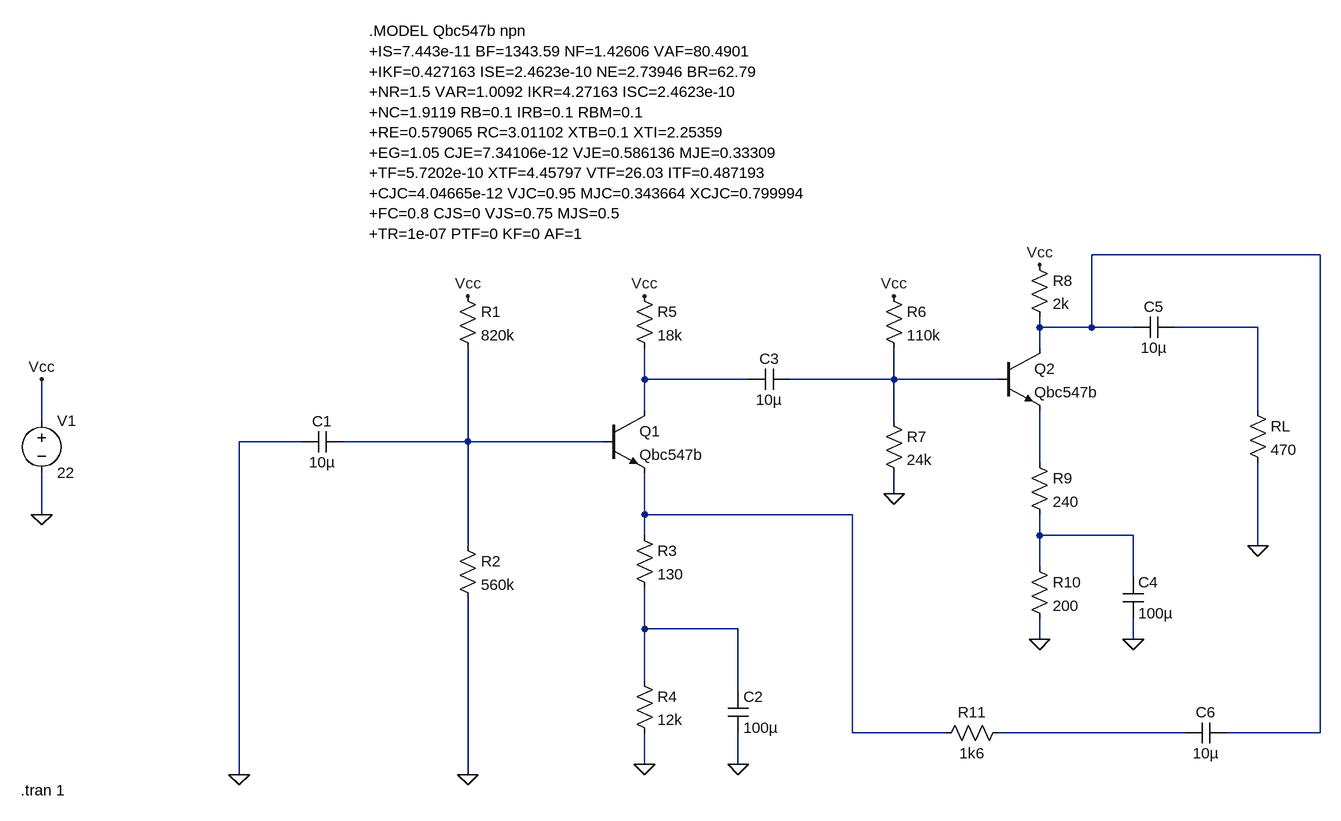
[diagram p0: schematic Simulacion.asc]
Simulacion.asc, the LTspice schematic file:
Version 4.1
SHEET 1 1396 856
WIRE 1392 16 1040 16
WIRE 960 128 960 112
WIRE 1040 128 1040 16
WIRE 1040 128 960 128
WIRE 1104 128 1040 128
WIRE 1296 128 1168 128
WIRE 960 160 960 128
WIRE 352 208 352 160
WIRE 512 208 352 208
WIRE 736 208 736 160
WIRE 736 208 576 208
WIRE 896 208 736 208
WIRE 352 256 352 208
WIRE 1296 256 1296 128
WIRE -576 272 -576 208
WIRE 736 272 736 208
WIRE -176 304 -272 304
WIRE 80 304 80 160
WIRE 80 304 -112 304
WIRE 288 304 80 304
WIRE 960 336 960 256
WIRE 736 384 736 352
WIRE -576 416 -576 352
WIRE 352 416 352 352
WIRE 672 416 352 416
WIRE 352 448 352 416
WIRE 960 448 960 416
WIRE 1104 448 960 448
WIRE 80 464 80 304
WIRE 1296 464 1296 336
WIRE 960 496 960 448
WIRE 1104 512 1104 448
WIRE 352 592 352 528
WIRE 496 592 352 592
WIRE 960 608 960 576
WIRE 1104 608 1104 576
WIRE 352 672 352 592
WIRE 496 688 496 592
WIRE 672 752 672 416
WIRE 816 752 672 752
WIRE 1184 752 896 752
WIRE 1392 752 1392 16
WIRE 1392 752 1248 752
WIRE 352 800 352 752
WIRE 496 800 496 752
WIRE -272 816 -272 304
WIRE 80 816 80 544
FLAG 960 608 0
FLAG 1104 608 0
FLAG 1296 464 0
FLAG 736 384 0
FLAG 496 800 0
FLAG 352 800 0
FLAG 80 816 0
FLAG -272 816 0
FLAG -576 416 0
FLAG -576 208 Vcc
FLAG 80 80 Vcc
FLAG 352 80 Vcc
FLAG 736 80 Vcc
FLAG 960 32 Vcc
SYMBOL res 64 64 R0
SYMATTR InstName R1
SYMATTR Value 820k
SYMBOL res 64 448 R0
SYMATTR InstName R2
SYMATTR Value 560k
SYMBOL cap -112 288 R90
WINDOW 0 0 32 VBottom 2
WINDOW 3 32 32 VTop 2
SYMATTR InstName C1
SYMATTR Value 10µ
SYMBOL res 336 432 R0
SYMATTR InstName R3
SYMATTR Value 130
SYMBOL res 336 656 R0
SYMATTR InstName R4
SYMATTR Value 12k
SYMBOL cap 480 688 R0
SYMATTR InstName C2
SYMATTR Value 100µ
SYMBOL res 336 64 R0
SYMATTR InstName R5
SYMATTR Value 18k
SYMBOL res 720 64 R0
SYMATTR InstName R6
SYMATTR Value 110k
SYMBOL cap 576 192 R90
WINDOW 0 0 32 VBottom 2
WINDOW 3 32 32 VTop 2
SYMATTR InstName C3
SYMATTR Value 10µ
SYMBOL npn 288 256 R0
SYMATTR InstName Q1
SYMATTR Value Qbc547b
SYMBOL res 720 256 R0
SYMATTR InstName R7
SYMATTR Value 24k
SYMBOL npn 896 160 R0
SYMATTR InstName Q2
SYMATTR Value Qbc547b
SYMBOL res 944 16 R0
SYMATTR InstName R8
SYMATTR Value 2k
SYMBOL res 944 320 R0
SYMATTR InstName R9
SYMATTR Value 240
SYMBOL res 944 480 R0
SYMATTR InstName R10
SYMATTR Value 200
SYMBOL cap 1088 512 R0
SYMATTR InstName C4
SYMATTR Value 100µ
SYMBOL cap 1168 112 R90
WINDOW 0 0 32 VBottom 2
WINDOW 3 32 32 VTop 2
SYMATTR InstName C5
SYMATTR Value 10µ
SYMBOL res 1280 240 R0
SYMATTR InstName RL
SYMATTR Value 470
SYMBOL voltage -576 256 R0
SYMATTR InstName V1
SYMATTR Value 22
SYMBOL cap 1248 736 R90
WINDOW 0 0 32 VBottom 2
WINDOW 3 32 32 VTop 2
SYMATTR InstName C6
SYMATTR Value 10µ
SYMBOL res 912 736 R90
WINDOW 0 0 56 VBottom 2
WINDOW 3 32 56 VTop 2
SYMATTR InstName R11
SYMATTR Value 1k6
TEXT -72 -328 Left 2 !.MODEL Qbc547b npn\n+IS=7.443e-11 BF=1343.59 NF=1.42606 VAF=80.4901\n+IKF=0.427163 ISE=2.4623e-10 NE=2.73946 BR=62.79\n+NR=1.5 VAR=1.0092 IKR=4.27163 ISC=2.4623e-10\n+NC=1.9119 RB=0.1 IRB=0.1 RBM=0.1\n+RE=0.579065 RC=3.01102 XTB=0.1 XTI=2.25359\n+EG=1.05 CJE=7.34106e-12 VJE=0.586136 MJE=0.33309\n+TF=5.7202e-10 XTF=4.45797 VTF=26.03 ITF=0.487193\n+CJC=4.04665e-12 VJC=0.95 MJC=0.343664 XCJC=0.799994\n+FC=0.8 CJS=0 VJS=0.75 MJS=0.5\n+TR=1e-07 PTF=0 KF=0 AF=1
TEXT -608 840 Left 2 !.tran 1

The netlist it stands for:
* Simulacion.asc
R1 Vcc N005 820k
R2 N005 0 560k
C1 N005 0 10µ
R3 N007 N009 130
R4 N009 0 12k
C2 N009 0 100µ
R5 Vcc N003 18k
R6 Vcc N004 110k
C3 N004 N003 10µ
Q1 N003 N005 N007 0 Qbc547b
R7 N004 0 24k
Q2 N001 N004 N006 0 Qbc547b
R8 Vcc N001 2k
R9 N006 N008 240
R10 N008 0 200
C4 N008 0 100µ
C5 N002 N001 10µ
RL N002 0 470
V1 Vcc 0 22
C6 N001 N010 10µ
R11 N010 N007 1k6
.model NPN NPN
.model PNP PNP
.lib standard.bjt
.MODEL Qbc547b npn
+IS=7.443e-11 BF=1343.59 NF=1.42606 VAF=80.4901
+IKF=0.427163 ISE=2.4623e-10 NE=2.73946 BR=62.79
+NR=1.5 VAR=1.0092 IKR=4.27163 ISC=2.4623e-10
+NC=1.9119 RB=0.1 IRB=0.1 RBM=0.1
+RE=0.579065 RC=3.01102 XTB=0.1 XTI=2.25359
+EG=1.05 CJE=7.34106e-12 VJE=0.586136 MJE=0.33309
+TF=5.7202e-10 XTF=4.45797 VTF=26.03 ITF=0.487193
+CJC=4.04665e-12 VJC=0.95 MJC=0.343664 XCJC=0.799994
+FC=0.8 CJS=0 VJS=0.75 MJS=0.5
+TR=1e-07 PTF=0 KF=0 AF=1
.tran 1
.backanno
.end